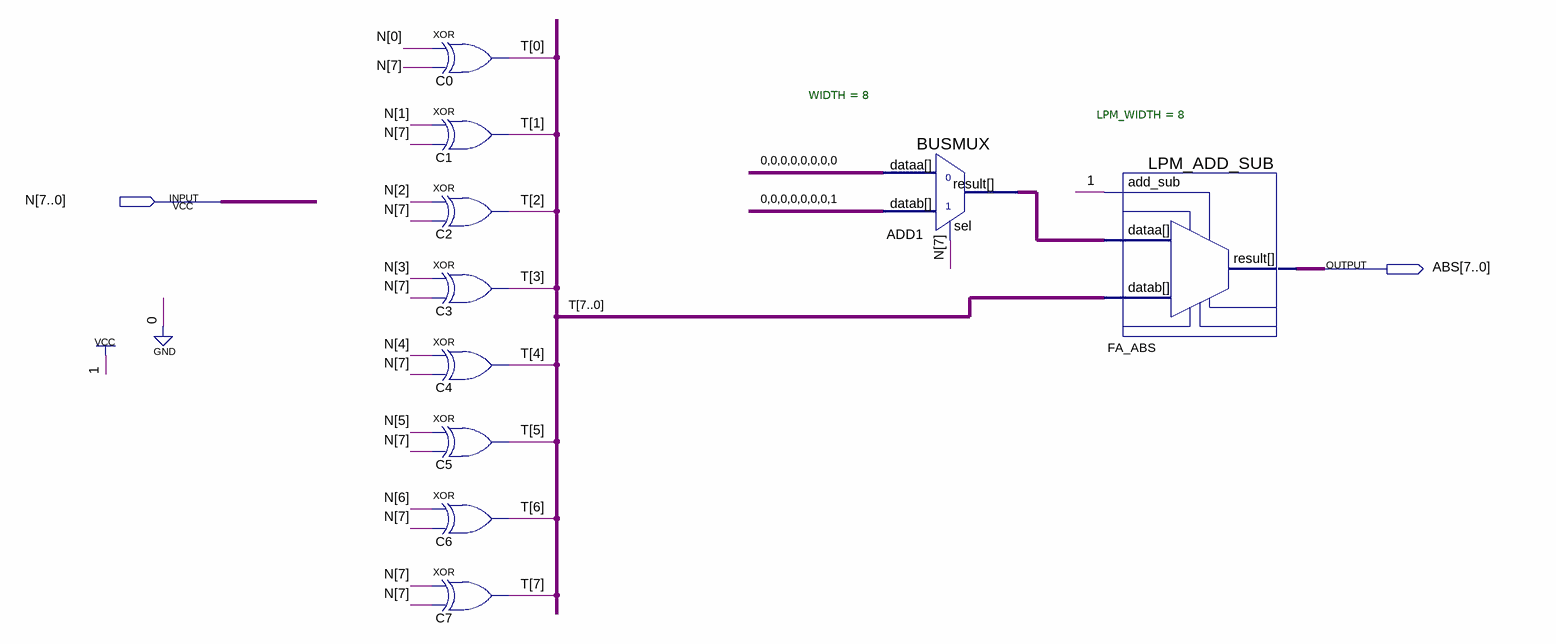
[diagram p0: schematic sheet]
// Quartus schematic abs.bdf as structural Verilog: 10 symbols, 2 pins
module abs (
  input  [7:0] N,
  output [7:0] ABS
);

  wire [7:0] ADD1_result, T;

  xor C0 (T[0], N[0], N[7]);
  xor C1 (T[1], N[1], N[7]);
  xor C2 (T[2], N[2], N[7]);
  xor C3 (T[3], N[3], N[7]);
  xor C4 (T[4], N[4], N[7]);
  xor C5 (T[5], N[5], N[7]);
  xor C6 (T[6], N[6], N[7]);
  xor C7 (T[7], N[7], N[7]);
  BUSMUX #(.WIDTH(8)) ADD1 (.datab(8'b00000001), .sel(N[7]), .dataa({8{1'b0}}), .result(ADD1_result));
  LPM_ADD_SUB #(.LPM_WIDTH(8)) FA_ABS (.add_sub(1'b1), .dataa(ADD1_result), .datab(T), .result(ABS));
endmodule
